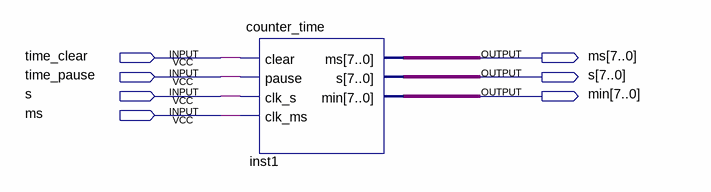
[diagram p0: schematic sheet]
// Quartus schematic time.bdf as structural Verilog: 1 symbols, 7 pins
module \time  (
  input  time_clear,
  input  time_pause,
  input  s_1bit,
  input  ms_1bit,
  output [7:0] ms,
  output [7:0] s,
  output [7:0] min
);

  counter_time inst1 (
    .clear(time_clear), .pause(time_pause), .clk_s(s_1bit), .clk_ms(ms_1bit), .ms(ms), .s(s), .min(min));
endmodule
